# EasyEDA Pro project ProPrj_Arduino_Contest_2025_2025-11-19.epro, schematic Hub_Module_Rev_0
Board Name: Hub_Module_Rev_0; Create Date: 2025-08-20; Page Name: MCU & LoRa; Project Name: Arduino_Prj_boards; Schematic Name: Hub_Module_Rev_0; Update Date: 2025-08-21; Revision: REV0
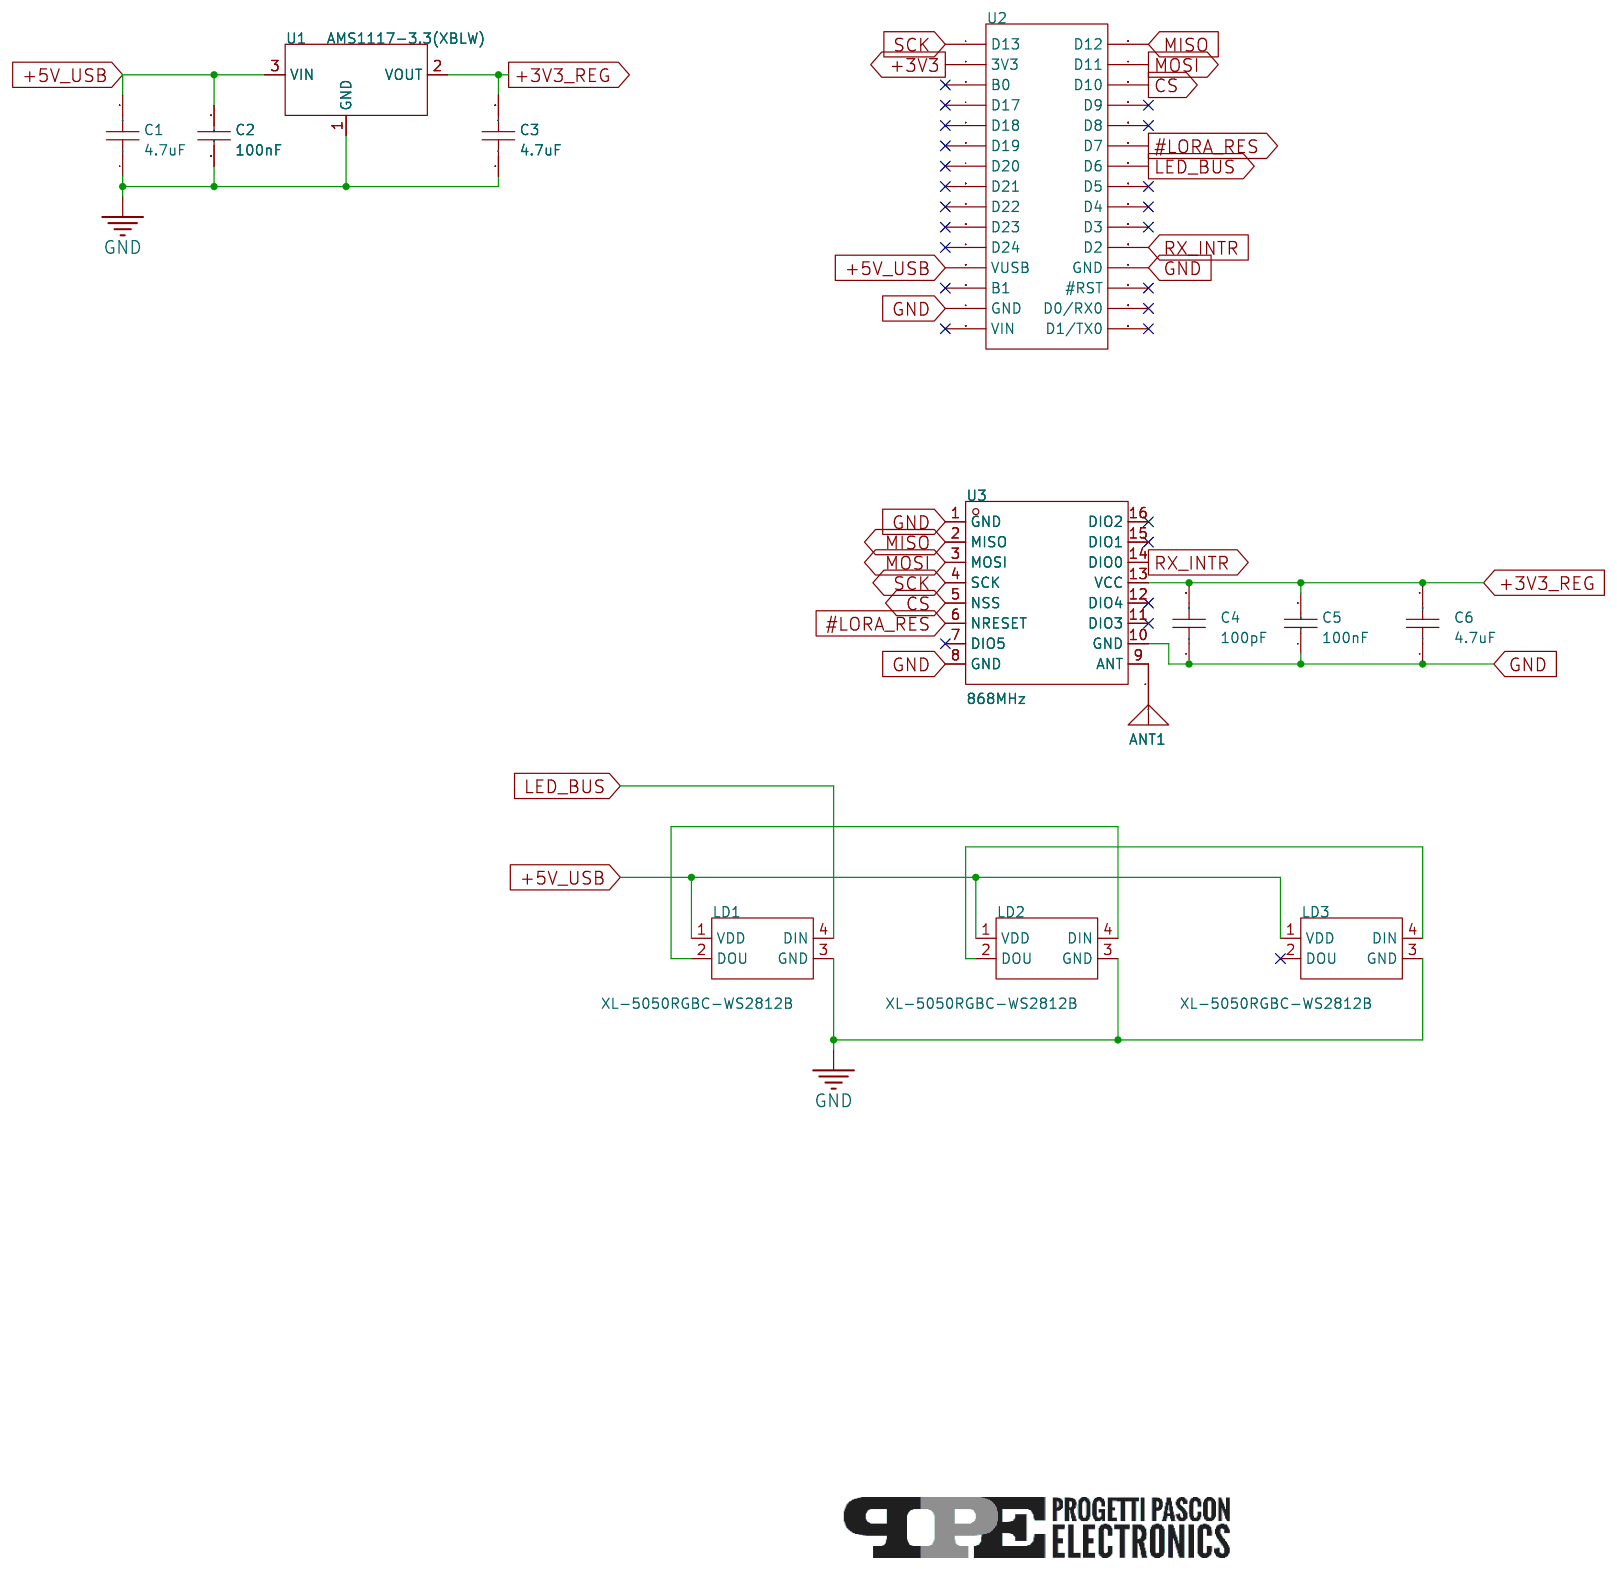
[diagram p0: schematic sheet]

## Parts
ANT1  VG868SNX18-5W2  [ANT-TH_VG868SNX18-5W2]
C1  4.7uF  [C1206]
C2  100nF  [C0603]
C3  4.7uF  [C1206]
C4  100pF  [C0603]
C5  100nF  [C0603]
C6  4.7uF  [C1206]
LD1  XL-5050RGBC-WS2812B  [LED-SMD_4P-L5.0-W5.0-BL_XL-5050RGBC]
LD2  XL-5050RGBC-WS2812B  [LED-SMD_4P-L5.0-W5.0-BL_XL-5050RGBC]
LD3  XL-5050RGBC-WS2812B  [LED-SMD_4P-L5.0-W5.0-BL_XL-5050RGBC]
U1  AMS1117-3.3(XBLW)  [SOT-223-3_L6.5-W3.4-P2.30-LS7.0-BR-1]
U2  -  [Arduino_NANO_ESP32]
U3  868MHz  [COMM-SMD_LORA1276-C1-915MHZ]

## Library data of the parts
ANT1 = VG868SNX18-5W2: LCSC Part Name: 868MHZ天线高增益弹簧; Supplier Part: C718843; Manufacturer: Vollgo(沃进); JLCPCB Part Class: Extended Part; Datasheet: https://atta.szlcsc.com/upload/public/pdf/source/20200806/C718843_9FD966E7A87F359AA794720160AB31F3.pdf; Supplier: LCSC
C1 C3 C6 = CL31B475KBHNNNE: Capacitance: Tolerance:±10% Tolerance:±10% Voltage Rated: Temperature Coefficient:; LCSC Part Name: 4.7uF ±10% 50V; Supplier Part: C51205; Manufacturer: SAMSUNG(三星); Supplier Footprint: 1206; JLCPCB Part Class: Extended Part; Datasheet: https://atta.szlcsc.com/upload/public/pdf/source/20160218/1457707763339.pdf; Supplier: LCSC; Tolerance: ±10%
C2 C5 = CC0603KRX7R9BB104: Capacitance:100nF Tolerance:±10% Tolerance:±10% Voltage Rating:50V Temperature Coefficient:X7R; LCSC Part Name: 100nF ±10% 50V; Supplier Part: C14663; Manufacturer: YAGEO(国巨); Supplier Footprint: 0603; JLCPCB Part Class: Basic Part; Datasheet: https://atta.szlcsc.com/upload/public/pdf/source/20250214/096C4C206003071F5D32E5F0D8E7F8DF.pdf; Supplier: LCSC; Tolerance: ±10%; Voltage Rating: 50V; Temperature Coefficient: X7R
C4 = CL10C101JB8NNNC: Capacitance: Tolerance:±5% Tolerance:±5% Voltage Rated: Temperature Coefficient:; LCSC Part Name: 100pF ±5% 50V; Supplier Part: C14858; Manufacturer: SAMSUNG(三星); Supplier Footprint: 0603; JLCPCB Part Class: Basic Part; Datasheet: https://atta.szlcsc.com/upload/public/pdf/source/20160218/1457707763339.pdf; Supplier: LCSC; Tolerance: ±5%
LD1-LD3 = XL-5050RGBC-WS2812B: Supplier Part: C2843785; Manufacturer: XINGLIGHT(成兴光); Supplier Footprint: SMD5050; JLCPCB Part Class: Extended Part; Datasheet: https://atta.szlcsc.com/upload/public/pdf/source/20240412/E1004CAA80592E31D08BFE019083806F.pdf; Supplier: LCSC
U1 = AMS1117-3.3(XBLW): Output Type:Fixed Maximum Input Voltage:15V Output Voltage:3.3V Output Voltage:3.3V Output Current:1A Power Supply Rejection Ratio (PSRR):60dB Dropout Voltage:1.3V standby current:4mA Noise:- Feature:Thermal Protection(TSD)；Overcurrent Protection(OCP) Ope; Supplier Part: C18906017; Manufacturer: XBLW(芯伯乐); Supplier Footprint: SOT-223; JLCPCB Part Class: Extended Part; Datasheet: https://atta.szlcsc.com/upload/public/pdf/source/20231019/F4230EEFC48908FC91962BB59ACA9AD6.pdf; Supplier: LCSC; Output Type: Fixed; Maximum Input Voltage: 15V; Output Voltage: 3.3V; Output Current: 1A; Power Supply Rejection Ratio (PSRR): 60dB; Dropout Voltage: 1.3V; standby current: 4mA; Feature: Thermal Protection(TSD)；Overcurrent Protection(OCP); Operating Temperature: -40℃~+125℃; Output Polarity: Positive electrode; Number of Outputs: 1
U2 = Arduino_NANO_ESP32
U3 = lora1276-C1-868MHz: Frequency:868MHz Output Power:20dBm Output Power:20dBm Interface Type:SPI Modulation System:LoRa；GFSK；FSK Voltage - Supply:1.8V~3.7V Voltage - Supply:1.8V~3.7V Receive  Current:10.8mA Send  Current:120mA Sensitivity:-139dBm Sensitivity:-139dBm; LCSC Part Name: 868MHz无线模块; Supplier Part: C3001532; Manufacturer: G-NiceRF(思为无线); Supplier Footprint: SMD,16x16mm; JLCPCB Part Class: Extended Part; Datasheet: https://atta.szlcsc.com/upload/public/pdf/source/20220425/530C73F5612432B98CDC262676D34B0B.pdf; Supplier: LCSC; Output Power: 20dBm; Interface Type: SPI; Modulation System: LoRa；GFSK；FSK; Voltage - Supply: 1.8V~3.7V; Receive  Current: 10.8mA; Send  Current: 120mA; Sensitivity: -139dBm

## Nets
+3V3: U2.2(3V3)
+3V3_REG: C3.2 C4.2 C5.2 C6.2 U1.2(VOUT) U3.13(VCC)
+5V_USB: C1.2 C2.2 LD1.1(VDD) LD2.1(VDD) LD3.1(VDD) U1.3(VIN) U2.12(VUSB)
GND: C1.1 C2.1 C3.1 C4.1 C5.1 C6.1 LD1.3(GND) LD2.3(GND) LD3.3(GND) U1.1(GND) U2.14(GND) U2.27(GND) U3.1(GND) U3.8(GND) U3.10(GND)
#LORA_RES: U2.21(D7) U3.6(NRESET)
CS: U2.18(D10) U3.5(NSS)
LED_BUS: LD1.4(DIN) U2.22(D6)
MISO: U2.16(D12) U3.2(MISO)
MOSI: U2.17(D11) U3.3(MOSI)
RX_INTR: U2.26(D2) U3.14(DIO0)
SCK: U2.1(D13) U3.4(SCK)
$2N825: ANT1.1 U3.9(ANT)
$2N1751: LD1.2(DOU) LD2.4(DIN)
$2N1765: LD2.2(DOU) LD3.4(DIN)

Not connected (* = marked no-connect by the designer): LD3 2(DOU)*; U2 3(B0)* 4(D17)* 5(D18)* 6(D19)* 7(D20)* 8(D21)* 9(D22)* 10(D23)* 11(D24)* 13(B1)* 15(VIN)* 19(D9)* 20(D8)* 23(D5)* 24(D4)* 25(D3)* 28(#RST)* 29(D0/RX0)* 30(D1/TX0)*; U3 7(DIO5)* 11(DIO3)* 12(DIO4)* 15(DIO1)* 16(DIO2)*
